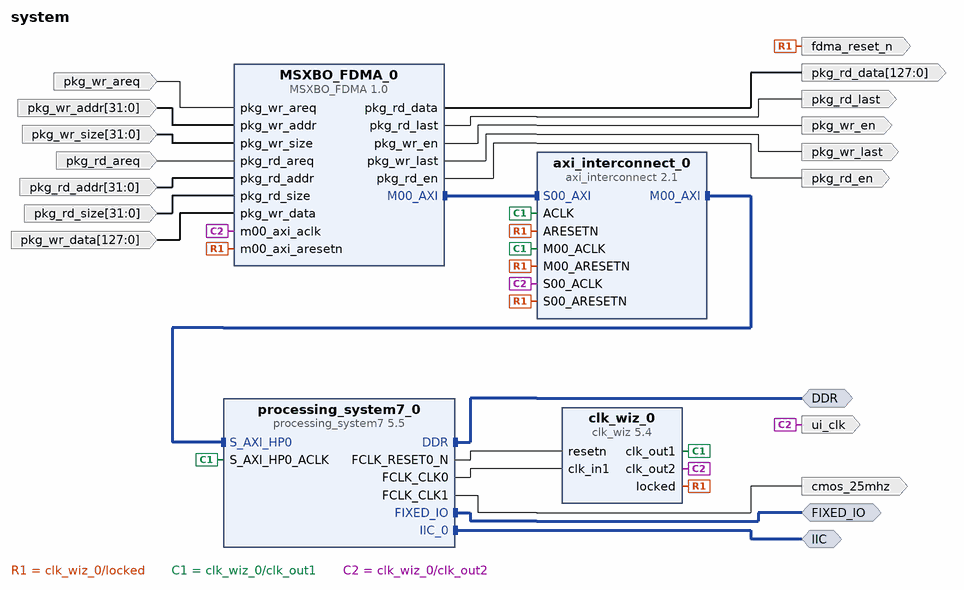
[diagram p0: block diagram of the top level]
# Vivado block design system, xc7z030ffg676-2, Vivado 2017.4
create_bd_design system

create_bd_intf_port -mode Master -vlnv xilinx.com:interface:ddrx_rtl:1.0 DDR
create_bd_intf_port -mode Master -vlnv xilinx.com:display_processing_system7:fixedio_rtl:1.0 FIXED_IO
create_bd_intf_port -mode Master -vlnv xilinx.com:interface:iic_rtl:1.0 IIC
create_bd_port -dir O -type rst fdma_reset_n
create_bd_port -dir O -type clk ui_clk
create_bd_port -dir I pkg_wr_areq
create_bd_port -dir I -from 31 -to 0 pkg_wr_addr
create_bd_port -dir I -from 31 -to 0 pkg_wr_size
create_bd_port -dir I pkg_rd_areq
create_bd_port -dir I -from 31 -to 0 pkg_rd_addr
create_bd_port -dir I -from 31 -to 0 pkg_rd_size
create_bd_port -dir O pkg_wr_last
create_bd_port -dir O pkg_wr_en
create_bd_port -dir O pkg_rd_last
create_bd_port -dir O -from 127 -to 0 pkg_rd_data
create_bd_port -dir O pkg_rd_en
create_bd_port -dir I -from 127 -to 0 pkg_wr_data
create_bd_port -dir O -type clk cmos_25mhz
set_property -dict {CONFIG.FREQ_HZ 25000000} [get_bd_ports cmos_25mhz]

create_bd_cell -type ip -vlnv xilinx.com:ip:processing_system7:5.5 processing_system7_0
set_property -dict [list \
  CONFIG.PCW_FCLK_CLK1_BUF TRUE \
  CONFIG.PCW_SDIO_PERIPHERAL_FREQMHZ 100 \
  CONFIG.PCW_UART_PERIPHERAL_FREQMHZ 100 \
  CONFIG.PCW_I2C_PERIPHERAL_FREQMHZ 111.111115 \
  CONFIG.PCW_FPGA0_PERIPHERAL_FREQMHZ 100 \
  CONFIG.PCW_FPGA1_PERIPHERAL_FREQMHZ 25 \
  CONFIG.PCW_USE_M_AXI_GP0 0 \
  CONFIG.PCW_USE_S_AXI_HP0 1 \
  CONFIG.PCW_EN_CLK1_PORT 1 \
  CONFIG.PCW_PRESET_BANK1_VOLTAGE {LVCMOS 1.8V} \
  CONFIG.PCW_UIPARAM_DDR_PARTNO {MT41K256M16 RE-125} \
  CONFIG.PCW_QSPI_PERIPHERAL_ENABLE 1 \
  CONFIG.PCW_QSPI_QSPI_IO {MIO 1 .. 6} \
  CONFIG.PCW_QSPI_GRP_SINGLE_SS_ENABLE 1 \
  CONFIG.PCW_QSPI_GRP_SINGLE_SS_IO {MIO 1 .. 6} \
  CONFIG.PCW_SINGLE_QSPI_DATA_MODE x4 \
  CONFIG.PCW_QSPI_GRP_FBCLK_ENABLE 1 \
  CONFIG.PCW_QSPI_GRP_FBCLK_IO {MIO 8} \
  CONFIG.PCW_ENET0_PERIPHERAL_ENABLE 1 \
  CONFIG.PCW_ENET0_ENET0_IO {MIO 16 .. 27} \
  CONFIG.PCW_ENET0_GRP_MDIO_ENABLE 1 \
  CONFIG.PCW_ENET0_GRP_MDIO_IO {MIO 52 .. 53} \
  CONFIG.PCW_SD0_PERIPHERAL_ENABLE 1 \
  CONFIG.PCW_SD0_SD0_IO {MIO 40 .. 45} \
  CONFIG.PCW_SD0_GRP_CD_ENABLE 1 \
  CONFIG.PCW_SD0_GRP_CD_IO {MIO 47} \
  CONFIG.PCW_SD0_GRP_WP_ENABLE 0 \
  CONFIG.PCW_UART1_PERIPHERAL_ENABLE 1 \
  CONFIG.PCW_UART1_UART1_IO {MIO 48 .. 49} \
  CONFIG.PCW_I2C0_PERIPHERAL_ENABLE 1 \
  CONFIG.PCW_I2C0_I2C0_IO EMIO \
  CONFIG.PCW_FPGA_FCLK1_ENABLE 1 \
] [get_bd_cells processing_system7_0]
# 136 more settings of processing_system7_0 are not shown: defaults, MIO pin electricals, DDR timing, and values the tool derives
create_bd_cell -type ip -vlnv xilinx.com:user:MSXBO_FDMA:1.0 MSXBO_FDMA_0
set_property -dict {CONFIG.C_M00_AXI_BURST_LEN 256 CONFIG.C_M00_AXI_DATA_WIDTH 128} [get_bd_cells MSXBO_FDMA_0]
create_bd_cell -type ip -vlnv xilinx.com:ip:axi_interconnect:2.1 axi_interconnect_0
set_property -dict {CONFIG.NUM_MI 1} [get_bd_cells axi_interconnect_0]
create_bd_cell -type ip -vlnv xilinx.com:ip:clk_wiz:5.4 clk_wiz_0
set_property -dict [list \
  CONFIG.CLKOUT2_USED true \
  CONFIG.NUM_OUT_CLKS 2 \
  CONFIG.CLKOUT1_REQUESTED_OUT_FREQ 200.000 \
  CONFIG.RESET_PORT resetn \
  CONFIG.MMCM_DIVCLK_DIVIDE 1 \
  CONFIG.MMCM_CLKOUT0_DIVIDE_F 5.000 \
  CONFIG.MMCM_CLKOUT1_DIVIDE 10 \
  CONFIG.RESET_TYPE ACTIVE_LOW \
  CONFIG.CLKOUT1_JITTER 114.829 \
  CONFIG.CLKOUT2_JITTER 130.958 \
  CONFIG.CLKOUT2_PHASE_ERROR 98.575 \
] [get_bd_cells clk_wiz_0]

# ---- connections ----

connect_bd_intf_net [get_bd_intf_pins MSXBO_FDMA_0/M00_AXI] [get_bd_intf_pins axi_interconnect_0/S00_AXI]
connect_bd_intf_net [get_bd_intf_pins axi_interconnect_0/M00_AXI] [get_bd_intf_pins processing_system7_0/S_AXI_HP0]
connect_bd_intf_net [get_bd_intf_ports DDR] [get_bd_intf_pins processing_system7_0/DDR]
connect_bd_intf_net [get_bd_intf_ports FIXED_IO] [get_bd_intf_pins processing_system7_0/FIXED_IO]
connect_bd_intf_net [get_bd_intf_ports IIC] [get_bd_intf_pins processing_system7_0/IIC_0]
connect_bd_net -net rst_ps7_0_100M_peripheral_aresetn [get_bd_pins clk_wiz_0/locked] \
  [get_bd_ports fdma_reset_n] [get_bd_pins MSXBO_FDMA_0/m00_axi_aresetn] [get_bd_pins axi_interconnect_0/S00_ARESETN] \
  [get_bd_pins axi_interconnect_0/M00_ARESETN] [get_bd_pins axi_interconnect_0/ARESETN]
connect_bd_net [get_bd_pins clk_wiz_0/clk_out1] \
  [get_bd_pins processing_system7_0/S_AXI_HP0_ACLK] [get_bd_pins axi_interconnect_0/ACLK] \
  [get_bd_pins axi_interconnect_0/M00_ACLK]
connect_bd_net -net S00_ACLK_1 [get_bd_pins clk_wiz_0/clk_out2] \
  [get_bd_ports ui_clk] [get_bd_pins MSXBO_FDMA_0/m00_axi_aclk] [get_bd_pins axi_interconnect_0/S00_ACLK]
connect_bd_net [get_bd_ports pkg_wr_areq] [get_bd_pins MSXBO_FDMA_0/pkg_wr_areq]
connect_bd_net -net pkg_wr_addr_0_1 [get_bd_ports pkg_wr_addr] [get_bd_pins MSXBO_FDMA_0/pkg_wr_addr]
connect_bd_net -net pkg_wr_size_0_1 [get_bd_ports pkg_wr_size] [get_bd_pins MSXBO_FDMA_0/pkg_wr_size]
connect_bd_net -net pkg_rd_areq_0_1 [get_bd_ports pkg_rd_areq] [get_bd_pins MSXBO_FDMA_0/pkg_rd_areq]
connect_bd_net -net pkg_rd_addr_0_1 [get_bd_ports pkg_rd_addr] [get_bd_pins MSXBO_FDMA_0/pkg_rd_addr]
connect_bd_net -net pkg_rd_size_0_1 [get_bd_ports pkg_rd_size] [get_bd_pins MSXBO_FDMA_0/pkg_rd_size]
connect_bd_net [get_bd_pins MSXBO_FDMA_0/pkg_wr_last] [get_bd_ports pkg_wr_last]
connect_bd_net [get_bd_pins MSXBO_FDMA_0/pkg_wr_en] [get_bd_ports pkg_wr_en]
connect_bd_net [get_bd_pins MSXBO_FDMA_0/pkg_rd_last] [get_bd_ports pkg_rd_last]
connect_bd_net [get_bd_pins MSXBO_FDMA_0/pkg_rd_data] [get_bd_ports pkg_rd_data]
connect_bd_net [get_bd_pins MSXBO_FDMA_0/pkg_rd_en] [get_bd_ports pkg_rd_en]
connect_bd_net [get_bd_pins processing_system7_0/FCLK_RESET0_N] [get_bd_pins clk_wiz_0/resetn]
connect_bd_net -net pkg_wr_data_0_1 [get_bd_ports pkg_wr_data] [get_bd_pins MSXBO_FDMA_0/pkg_wr_data]
connect_bd_net [get_bd_pins processing_system7_0/FCLK_CLK0] [get_bd_pins clk_wiz_0/clk_in1]
connect_bd_net [get_bd_pins processing_system7_0/FCLK_CLK1] [get_bd_ports cmos_25mhz]

# ---- address map ----
assign_bd_address -offset 0x00000000 -range 1G -target_address_space [get_bd_addr_spaces MSXBO_FDMA_0/M00_AXI] [get_bd_addr_segs processing_system7_0/S_AXI_HP0/HP0_DDR_LOWOCM]

validate_bd_design
save_bd_design
